# Altium project RFID_system.PrjPcb
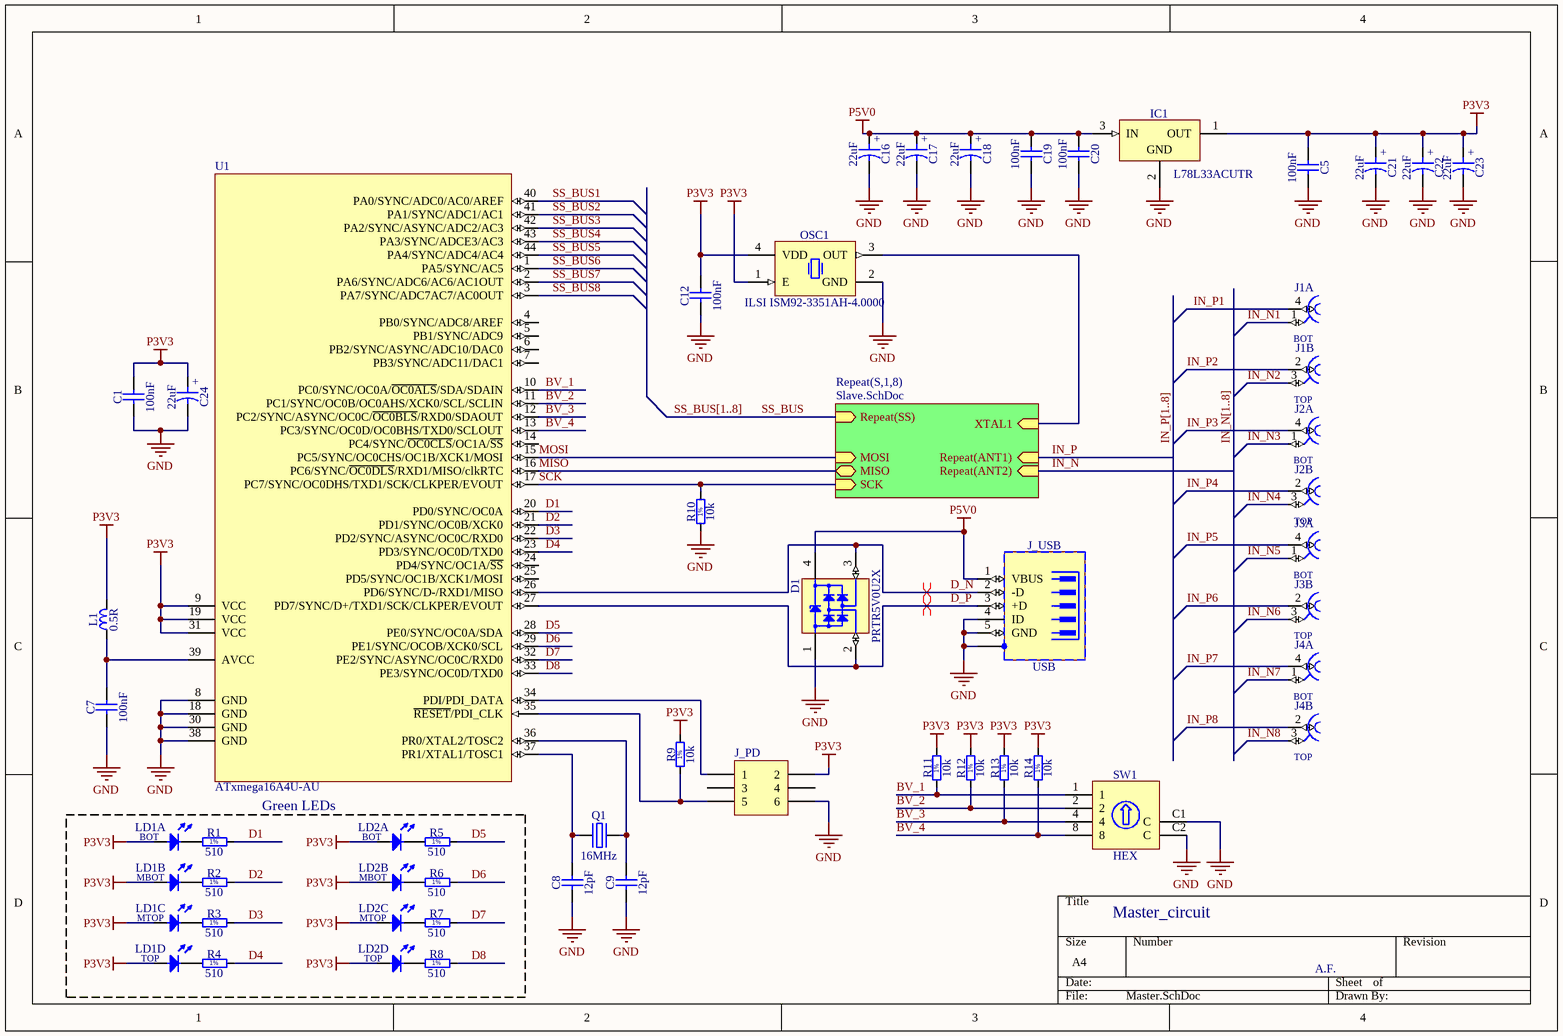
[diagram p0: Master.SchDoc]
2 sheets, 212 parts. Net scope: hierarchical (ports join the sheet entries above them; power ports are global).
Board file: RFID_PCB.PcbDoc
Sheets:
  Master.SchDoc
    S1 = Slave.SchDoc
    S2 = Slave.SchDoc
    S3 = Slave.SchDoc
    S4 = Slave.SchDoc
    S5 = Slave.SchDoc
    S6 = Slave.SchDoc
    S7 = Slave.SchDoc
    S8 = Slave.SchDoc

## Sheet Master.SchDoc: Master_circuit
size A4; DrawnBy: A.F.; ProjectName: RFID_system

### Parts
C1  100nF  [CAPC1608X87N]
C5  100nF  [CAPC1608X87N]
C7  100nF  [CAPC1608X87N]
C8  12pF  [CAPC1608X87N]
C9  12pF  [CAPC1608X87N]
C12  100nF  [CAPC1608X87N]
C16  22uF  [CAPAE430X540N]
C17  22uF  [CAPAE430X540N]
C18  22uF  [CAPAE430X540N]
C19  100nF  [CAPC1608X87N]
C20  100nF  [CAPC1608X87N]
C21  22uF  [CAPAE430X540N]
C22  22uF  [CAPAE430X540N]
C23  22uF  [CAPAE430X540N]
C24  22uF  [CAPAE430X540N]
D1  PRTR5V0U2X  [SOT190P230X110-4N]
IC1  L78L33ACUTR  [SOT89]
J1  Family  [RENHOTEC_RHT-610-0049]  (value not drawn)  (parts A,B of 2)
J2  Family  [RENHOTEC_RHT-610-0049]  (value not drawn)  (parts A,B of 2)
J3  Family  [RENHOTEC_RHT-610-0049]  (value not drawn)  (parts A,B of 2)
J4  Family  [RENHOTEC_RHT-610-0049]  (value not drawn)  (parts A,B of 2)
J_PD  (no value)  [HDR2X3]
J_USB  USB  [WURTH_651005136521]
L1  0.5R  [1608[0603]]
LD1  Green  [LED_BIVAR_H485CGDL]  (value not drawn)  (parts A,B,C,D of 4)
LD2  Green  [LED_BIVAR_H485CGDL]  (value not drawn)  (parts A,B,C,D of 4)
OSC1  ILSI ISM92-3351AH-4.0000  [OSCSC250P320X500X130-4N]
Q1  16MHz  [XTAL1160X490X430]
R1  510  [RESC1608X55N]
R2  510  [RESC1608X55N]
R3  510  [RESC1608X55N]
R4  510  [RESC1608X55N]
R5  510  [RESC1608X55N]
R6  510  [RESC1608X55N]
R7  510  [RESC1608X55N]
R8  510  [RESC1608X55N]
R9  10k  [RESC1608X55N]
R10  10k  [RESC1608X55N]
R11  10k  [RESC1608X55N]
R12  10k  [RESC1608X55N]
R13  10k  [RESC1608X55N]
R14  10k  [RESC1608X55N]
SW1  HEX  [SW_OMRON_A6RV-162RF]
U1  ATxmega16A4U-AU  [44A_N]

### Blocks framed on the sheet
Green LEDs: LD1 LD2 R1-R8

### Sub-sheets
Repeat(S,1,8) = Slave.SchDoc: MOSI (in), MISO, SCK (in), Repeat(SS) (in), Repeat(ANT1) (in), Repeat(ANT2) (in), XTAL1 (in)

### Nets
GND: C1.1 C5.2 C7.1 C8.1 C9.1 C12.1 C16.2 C17.2 C18.2 C19.2 C20.2 C21.2 C22.2 C23.2 C24.2 D1.1(GND) IC1.2(GND) J_PD.6 J_USB.4(ID) J_USB.5(GND) J_USB.6(SH) OSC1.2(GND) R10.1 SW1.C1(C) SW1.C2(C) U1.8(GND) U1.18(GND) U1.30(GND) U1.38(GND)
P3V3: C1.2 C5.1 C12.2 C21.1 C22.1 C23.1 C24.1 IC1.1(OUT) J_PD.2 L1.2 LD1.2(A) LD1.4(A) LD1.6(A) LD1.8(A) LD2.2(A) LD2.4(A) LD2.6(A) LD2.8(A) OSC1.1(E) OSC1.4(VDD) R9.2 R11.2 R12.2 R13.2 R14.2 U1.9(VCC) U1.19(VCC) U1.31(VCC)
P5V0: C16.1 C17.1 C18.1 C19.1 C20.1 D1.4(VCC) IC1.3(IN) J_USB.1(VBUS)
BV_1: R11.1 SW1.1 U1.10(PC0/SYNC/OC0A/~{OC0ALS}/SDA/SDAIN)
BV_2: R12.1 SW1.2 U1.11(PC1/SYNC/OC0B/OC0AHS/XCK0/SCL/SCLIN)
BV_3: R13.1 SW1.4 U1.12(PC2/SYNC/ASYNC/OC0C/~{OC0BLS}/RXD0/SDAOUT)
BV_4: R14.1 SW1.8 U1.13(PC3/SYNC/OC0D/OC0BHS/TXD0/SCLOUT)
D1: R1.2 U1.20(PD0/SYNC/OC0A)
D2: R2.2 U1.21(PD1/SYNC/OC0B/XCK0)
D3: R3.2 U1.22(PD2/SYNC/ASYNC/OC0C/RXD0)
D4: R4.2 U1.23(PD3/SYNC/OC0D/TXD0)
D5: R5.2 U1.28(PE0/SYNC/OC0A/SDA)
D6: R6.2 U1.29(PE1/SYNC/OCOB/XCK0/SCL)
D7: R7.2 U1.32(PE2/SYNC/ASYNC/OC0C/RXD0)
D8: R8.2 U1.33(PE3/SYNC/OC0D/TXD0)
D_N: D1.3(I/O2) J_USB.2(-D) U1.26(PD6/SYNC/D-/RXD1/MISO)
D_P: D1.2(I/O1) J_USB.3(+D) U1.27(PD7/SYNC/D+/TXD1/SCK/CLKPER/EVOUT)
IN_N: sheet Repeat(S,1,8)/Repeat(ANT2)
IN_N1: J1.1
IN_N2: J1.3
IN_N3: J2.1
IN_N4: J2.3
IN_N5: J3.1
IN_N6: J3.3
IN_N7: J4.1
IN_N8: J4.3
IN_P: sheet Repeat(S,1,8)/Repeat(ANT1)
IN_P1: J1.4
IN_P2: J1.2
IN_P3: J2.4
IN_P4: J2.2
IN_P5: J3.4
IN_P6: J3.2
IN_P7: J4.4
IN_P8: J4.2
MISO: U1.16(PC6/SYNC/~{OC0DLS}/RXD1/MISO/clkRTC) ; sheet Repeat(S,1,8)/MISO
MOSI: U1.15(PC5/SYNC/OC0CHS/OC1B/XCK1/MOSI) ; sheet Repeat(S,1,8)/MOSI
SCK: R10.2 U1.17(PC7/SYNC/OC0DHS/TXD1/SCK/CLKPER/EVOUT) ; sheet Repeat(S,1,8)/SCK
SS_BUS: sheet Repeat(S,1,8)/Repeat(SS)
SS_BUS1: U1.40(PA0/SYNC/ADC0/AC0/AREF)
SS_BUS2: U1.41(PA1/SYNC/ADC1/AC1)
SS_BUS3: U1.42(PA2/SYNC/ASYNC/ADC2/AC3)
SS_BUS4: U1.43(PA3/SYNC/ADCE3/AC3)
SS_BUS5: U1.44(PA4/SYNC/ADC4/AC4)
SS_BUS6: U1.1(PA5/SYNC/AC5)
SS_BUS7: U1.2(PA6/SYNC/ADC6/AC6/AC1OUT)
SS_BUS8: U1.3(PA7/SYNC/ADC7AC7/AC0OUT)
XTAL1: OSC1.3(OUT) ; sheet Repeat(S,1,8)/XTAL1
NetC7_2: C7.2 L1.1 U1.39(AVCC)
NetC8_2: C8.2 Q1.1(OSC1) U1.37(PR1/XTAL1/TOSC1)
NetC9_2: C9.2 Q1.2(OSC2) U1.36(PR0/XTAL2/TOSC2)
NetJ_PD_1: J_PD.1 U1.34(PDI/PDI_DATA)
NetJ_PD_5: J_PD.5 R9.1 U1.35(~{RESET}/PDI_CLK)
NetLD1_1: LD1.1(C) R1.1
NetLD1_3: LD1.3(C) R2.1
NetLD1_5: LD1.5(C) R3.1
NetLD1_7: LD1.7(C) R4.1
NetLD2_1: LD2.1(C) R5.1
NetLD2_3: LD2.3(C) R6.1
NetLD2_5: LD2.5(C) R7.1
NetLD2_7: LD2.7(C) R8.1

Not connected (* = marked no-connect by the designer): J_PD 3 4; U1 4(PB0/SYNC/ADC8/AREF) 5(PB1/SYNC/ADC9) 6(PB2/SYNC/ASYNC/ADC10/DAC0) 7(PB3/SYNC/ADC11/DAC1) 14(PC4/SYNC/~{OC0CLS}/OC1A/~{SS}) 24(PD4/SYNC/OC1A/~{SS}) 25(PD5/SYNC/OC1B/XCK1/MOSI)

### Buses and harness runs
bus IN_N[1..8]
bus IN_P[1..8]
bus SS_BUS[1..8]

### Layout directives
differential pair: D_N, D_P

### Notes on the sheet
- Labels drawn without touching a wire or pin: \
- (in symbol CAE430-540_22UF_10V_20%) +
- (in symbol CON_BNC_DUAL, part A) BOT
- (in symbol CON_BNC_DUAL, part B) TOP
- (in symbol LED x4 Green 1C2A-BOT_3C4A_5C6A_7C8A-TOP, part A) BOT
- (in symbol LED x4 Green 1C2A-BOT_3C4A_5C6A_7C8A-TOP, part B) MBOT
- (in symbol LED x4 Green 1C2A-BOT_3C4A_5C6A_7C8A-TOP, part C) MTOP
- (in symbol LED x4 Green 1C2A-BOT_3C4A_5C6A_7C8A-TOP, part D) TOP
- (in symbol R0603_10K_1%_0.1W_100PPM) 1%
- (in symbol R0603_510R_1%_0.1W_100PPM) 1%

### Library data of the parts
C1 C5 C7 C12 C19 C20 = CC0603_100NF_50V_10%_X5R: Non-polarised capacitor; Part Description: SMD Multilayer Chip Ceramic Capacitor; Manufacturer: GENERIC; Manufacturer1 Part Number: C1608X5R1H104K080AA; Voltage: 50V; TC: X5R; Tolerance: ±10%; Part Number: CC0603_100NF_50V_10%_X5R; Component Kind: Standard; Component Type: Standard; Pin Count: 2; Value: 100nF; Status: None; Manufacturer Part Number: CC0603_100NF_50V_10%_X5R; Case: 0603; Mounted: Yes; Socket: No; SMD: Yes; Sense: No; Manufacturer1 Example: TDK; Manufacturer1 ComponentHeight: 0.9mm; HelpURL: \\cern.ch\dfs\Applications\Altium\Datasheets\CC0603_X5R_TDK_C.pdf; Author: CERN DEM MR; CreateDate: 08.01.2016; LatestRevisionDate: 08.01.2016
C8 C9 = CC0603_12PF_50V_5%_NP0: Non-polarised capacitor; Part Description: SMD Multilayer Chip Ceramic Capacitor; Manufacturer: GENERIC; Manufacturer1 Part Number: 223886715129; Voltage: 50V; TC: C0G/NP0; Tolerance: ±5%; Part Number: CC0603_12PF_50V_5%_NP0; Component Kind: Standard; Component Type: Standard; Pin Count: 2; Value: 12pF; Status: Preferred; Manufacturer Part Number: CC0603_12PF_50V_5%_NP0; Case: 0603; Mounted: Yes; Socket: No; SMD: Yes; Sense: No; Manufacturer1 Example: PHYCOMP; Manufacturer1 ComponentHeight: 0.87mm; HelpURL: \\cern.ch\dfs\Applications\Altium\Datasheets\CC0603_NP0_PHYCOMP.pdf; Author: CERN DEM JLC; CreateDate: 03.12.2007; LatestRevisionDate: 03.12.2007
C16-C18 C21-C24 = CAE430-540_22UF_10V_20%: Polarised capacitor; Part Description: Aluminum Electrolytic SMT Capacitor; Manufacturer: PANASONIC; Manufacturer Part Number: EEEFK1A220AR; Voltage: 10V; Tolerance: ±20%; Part Number: CAE430-540_22UF_10V_20%; Component Kind: Standard; Component Type: Standard; Pin Count: 2; Value: 22uF; Status: Not Recommended; Case: B; Mounted: Yes; Socket: No; SMD: Yes; Sense: No; ComponentHeight: 5.8mm; HelpURL: \\cern.ch\dfs\Applications\Altium\Datasheets\CAE_PANASONIC_FK.pdf; Author: CERN DEM JLC; CreateDate: 2007-12-03; LatestRevisionDate: 2014-11-05
D1 = PRTR5V0U2X: Ultra Low Capacitance Double Rail-to-Rail ESD Protection Diode; Part Description: Ultra Low Capacitance (1pF) Double Rail-to-Rail ESD Protection Diode (8kV); Manufacturer: NXP SEMICONDUCTORS; Voltage: 5.5V; PressFit: No; Bonding: No; Part Number: PRTR5V0U2X; Component Kind: Standard; Component Type: Standard; Device: PRTR5V0U2X; PackageDescription: SOT143B, SOT, 1.90mm Pitch; 4 Pin, 1.30mm W X 2.90mm L X 1.10mm H body, IPC Medium Density; Manufacturer Part Number: PRTR5V0U2X; Pin Count: 4; Case: SOT143B; Mounted: Yes; Socket: No; SMD: Yes; Sense: No; ComponentHeight: 1.1mm; HelpURL: \\cern.ch\dfs\Applications\Altium\Datasheets\PRTR5V0U2X.pdf; Author: CERN DEM JLC; CreateDate: 2011-03-22; LatestRevisionDate: 2011-03-22
IC1 = L78L33ACUTR: 3-Terminal Regulator 1=OUT 2=GND 3=IN; Part Description: 33V 100mA Positive Voltage Regulator; Manufacturer: ST MICROELECTRONICS; PressFit: No; Bonding: No; Part Number: L78L33ACUTR; Component Kind: Standard; Component Type: Standard; Device: L78L33ACUTR; PackageDescription: SOT89-3, 3-Leads, Body 2.44x4.5mm; Manufacturer Part Number: L78L33ACUTR; Pin Count: 4; Case: SOT89; Mounted: Yes; Socket: No; SMD: Yes; Sense: No; ComponentHeight: 1.6mm; HelpURL: \\cern.ch\dfs\Applications\Altium\Datasheets\L78L33ACUTR.pdf; Author: CERN DEM JLC; CreateDate: 2014-05-12; LatestRevisionDate: 2014-05-12
J1-J4 = CON_BNC_DUAL: Dual Right Angle 50 Ohm BNC Jack, White Valox Case; Manufacturer: RENHOTEC; Manufacturer Part Number: RHT-610-0049; PressFit: No; Part Number: RENHOTEC_RHT-610-0049; Component Kind: Standard; Component Type: Standard; Pin Count: 6; Family: BNC; Mounted: Yes; Socket: No; SMD: No; Sense: No; Status: None; Part Description: Dual Right Angle 50 Ohm BNC Jack, White Valox Case; ComponentHeight: 29.3mm; HelpURL: \\cern.ch\dfs\Applications\Altium\Datasheets\BOMAR_364A2595.pdf; Author: GK; CreateDate: 09.04.2013; LatestRevisionDate: 09.04.2013
J_PD = Header 3X2: Header, 3-Pin, Dual row; LatestRevisionDate: 17-Jul-2002; LatestRevisionNote: Re-released for DXP Platform.; Publisher: Altium Limited
J_USB = WURTH_651005136521: 5 Pin + 1 Shield USB Receptacle; Part Description: Mini USB Type B  Receptacle, Horizontal, 5 Contacts; Manufacturer: WURTH ELEKTRONIK; PressFit: No; Part Number: WURTH_651005136521; Component Kind: Standard; Component Type: Standard; Pin Count: 6; Family: USB; Mounted: Yes; Socket: No; SMD: No; Sense: No; Status: None; Manufacturer Part Number: 651005136521; ComponentHeight: 3.9mm; HelpURL: \\cern.ch\dfs\Applications\Altium\Datasheets\WURTH_651005136521.pdf; Author: CERN DEM JLC; CreateDate: 2011-03-07; LatestRevisionDate: 2011-03-07
L1 = IND_1UH_20%_BOURNS_SRP4020TA: Ferrite Bead; Manufacturer: MURATA; Part number: BLM18HE152SN1D; Power: 0.5A; Impedence at 100MHZ: 1500R; Footprint: 0603; Pin Count: 2; Value: 0.5R; Status: None; Resistance: 0.5R; Part Description: Ferrite bead; Mounted: Yes; Socket: No; SMD: Yes; HelpURL: https://www.tme.eu/html/EN/murata-smd-beads/ramka_6596_EN_pelny.html; Author: CERN DEM BC; Producer: Murata
LD1 LD2 = LED x4 Green 1C2A-BOT_3C4A_5C6A_7C8A-TOP: Part Description: Quad-Level 2mm Green LED, PCB Edge Mounting; Manufacturer: BIVAR; Manufacturer Part Number: H485CGDL; PressFit: No; Bonding: No; Part Number: LED_BIVAR_H485CGDL; Component Kind: Standard; Component Type: Standard; Color: Green; PackageDescription: Quad-Level 2mm Green, PCB Edge Mounting  BIVAR H485CHDL; Pin Count: 8; Mounted: Yes; Socket: No; SMD: No; Sense: No; ComponentHeight: 11.3mm; HelpURL: \\cern.ch\dfs\Applications\Altium\Datasheets\LED_BIVAR_H485CGDL.pdf; Author: CERN DEM JLC; CreateDate: 2012-06-04; LatestRevisionDate: 2012-06-04
OSC1 = Oscillator 1E 2GND 3OUT 4VDD: Oscillator 4 pins 3.3V 4MHz; URL: https://www.tme.eu/pl/Document/04fa0ef07f38450711886bdf482cf79c/ISM92_Series.pdf
Q1 = XTAL_16MHZ_IQD_LFXTAL003237: Quartz Crystal; Part Description: Tolerance: ± 30ppm, Stability: ± 50ppm, -10°C to +60°C, 16pF, Surface Mount Quartz Crystal, HC49/4HSMX Series; Manufacturer: IQD FREQUENCY PRODUCTS; PressFit: No; Bonding: No; Part Number: XTAL_16MHZ_IQD_LFXTAL003237; Component Kind: Standard; Component Type: Standard; PackageDescription: HC49/4H SMX Case, SMD Cristal, Body 11.6x4.9mm; Value: 16MHz; Manufacturer Part Number: LF XTAL003237; Pin Count: 2; Mounted: Yes; Socket: No; SMD: Yes; Sense: No; ComponentHeight: 4.3mm; HelpURL: \\cern.ch\dfs\Applications\Altium\Datasheets\XTAL_IQD_LFXTAL003237.pdf; Author: CERN DEM MR; CreateDate: 2016-03-23; LatestRevisionDate: 2016-11-07
R1-R8 = R0603_510R_1%_0.1W_100PPM: Resistor - 1%; Part Description: General Purpose Thick Film Chip Resistor; Manufacturer: GENERIC; Manufacturer1 Part Number: NRC06F5100TRF; Power: 0.1W; TC: ±100ppm/°C; PressFit: No; Part Number: R0603_510R_1%_0.1W_100PPM; Component Kind: Standard; Component Type: Standard; Pin Count: 2; Value: 510; Status: Preferred; Tolerance: ±1%; Manufacturer Part Number: R0603_510R_1%_0.1W_100PPM; Case: 0603; Mounted: Yes; Sense: No; Socket: No; SMD: Yes; Manufacturer1 Example: NIC COMPONENT; Manufacturer1 ComponentHeight: 0.55mm; HelpURL: \\cern.ch\dfs\Applications\Altium\Datasheets\R0603_NIC_NRC.pdf; Author: CERN DEM JLC; CreateDate: 2007-12-03; LatestRevisionDate: 2008-03-13
R9-R14 = R0603_10K_1%_0.1W_100PPM: Resistor - 1%; Part Description: General Purpose Thick Film Chip Resistor; Manufacturer: GENERIC; Manufacturer1 Part Number: NRC06F1002TRF; Power: 0.1W; TC: ±100ppm/°C; PressFit: No; Part Number: R0603_10K_1%_0.1W_100PPM; Component Kind: Standard; Component Type: Standard; Pin Count: 2; Value: 10k; Status: Preferred; Tolerance: ±1%; Manufacturer Part Number: R0603_10K_1%_0.1W_100PPM; Case: 0603; Mounted: Yes; Sense: No; Socket: No; SMD: Yes; Manufacturer1 ComponentHeight: 0.55mm; HelpURL: \\cern.ch\dfs\Applications\Altium\Datasheets\R0603_NIC_NRC.pdf; Author: CERN DEM JLC; CreateDate: 03.12.2007; LatestRevisionDate: 13.03.2008; Manufacturer1 Example: NIC COMPONENT
SW1 = SW_OMRON_A6RV-162RF: Rotary Code Switch 1 2 4 8 C1 C2; Part Number: SW_OMRON_A6RV-162RF or ERD716RR; Part Description: Side Actuated, Hexadecimal Rotary Code Switch; Manufacturer: OMRON; Manufacturer Part Number: A6RV-162RF or ERD716RR; PressFit: No; Component Kind: Standard; Component Type: Standard; Pin Count: 6; PackageDescription: Body 9.8x6.64mm, Side Actuated, Rotary Code Switch, OMRON A6RV Series; Family: HEX; Mounted: Yes; Socket: No; SMD: No; Sense: No; Status: None; ComponentHeight: 9.9mm; HelpURL: \\cern.ch\dfs\Applications\Altium\Datasheets\SW_OMRON_A6RV.pdf; Author: CERN DEM JLC; CreateDate: 2008-11-27; LatestRevisionDate: 2011-01-19
U1 = ATxmega16A4-AU: 8/16-bit AVR XMEGA A4 Microcontroller, 1.6-3.6V, 16KB + 4KB Flash, 1KB EEPROM, 2KB SRAM, 44-pin TQFP, Industrial Grade (-40°C to 85°C), Pb-Free; Published: 1-Apr-2010; DatasheetVersion: revN, Feb-2010; PackageVersion: rev.B, Oct-2001; PackageReference: 44A; Publisher: Altium Limited; PackageDescription: 44-Pin Plastic Thin Profile Quad Flat Pack, 10 x 10 x 1.0 mm Body, 0.8 mm Pitch (TQFP); Supplier 1: Digi-Key; Supplier Part Number 1: ATXMEGA16A4-AU-ND; Supplier 2: Farnell; Supplier Part Number 2: 1748552; Supplier 3: Mouser; Supplier Part Number 3: 556-ATXMEGA16A4-AU; ComponentLink1Description: Manufacturer Link; ComponentLink1URL: http://www.atmel.com/products/avr/default.asp?; ComponentLink2Description: ATxmega16A4/32A4/64A4/128A4 Datasheet; ComponentLink2URL: http://www.atmel.com/dyn/resources/prod_documents/doc8069.pdf; ComponentLink3Description: Atmel.com Home; ComponentLink3URL: http://www.atmel.com

## Sheet Slave.SchDoc: Slave_subcircuit
size A4; DrawnBy: A.F
Used 8 times, as channels S1, S2, S3, S4, S5, S6, S7, S8. Parts and nets are listed once, with the designators drawn on the sheet.
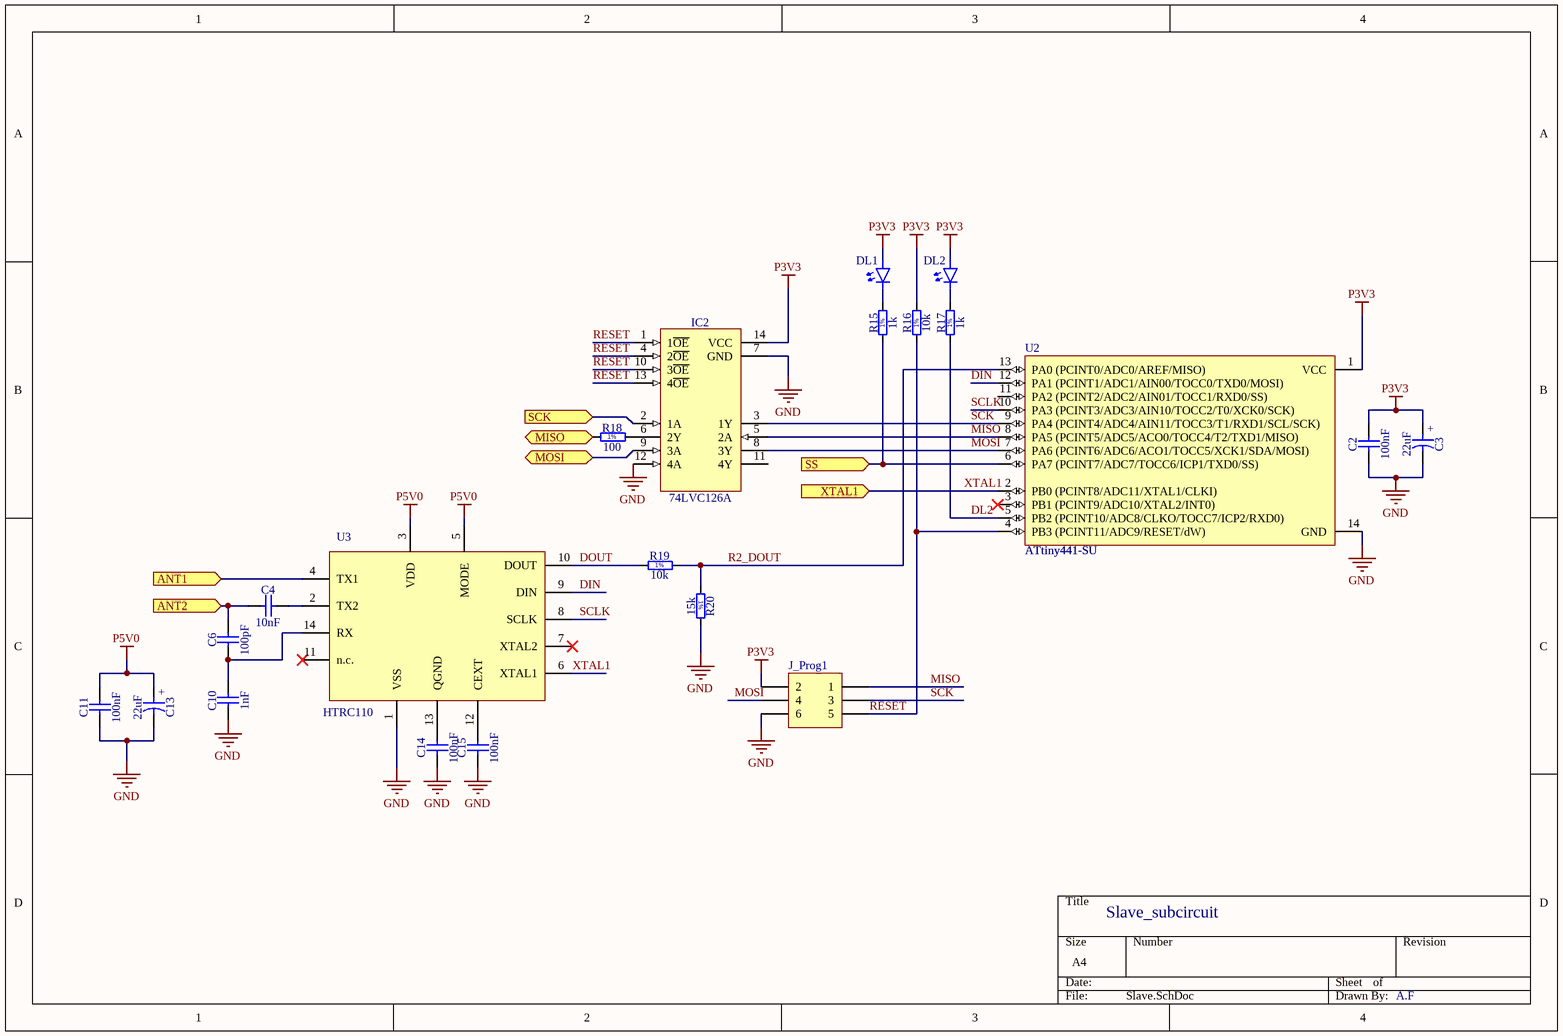
[diagram p1: Slave.SchDoc]

### Parts
C2  100nF  [CAPC1608X87N]
C3  22uF  [CAPAE430X540N]
C4  10nF  [CAPC1608X87N]
C6  100pF  [CAPC1608X90N]
C10  1nF  [CAPC1608X87N]
C11  100nF  [CAPC1608X87N]
C13  22uF  [CAPAE430X540N]
C14  100nF  [CAPC1608X87N]
C15  100nF  [CAPC1608X87N]
DL1  (no value)  [0805_LED]
DL2  (no value)  [0805_LED]
IC2  74LVC126A  [SOIC127P600X175-14N]
J_Prog1  (no value)  [HDR2X3]
R15  1k  [RESC1608X50N]
R16  10k  [RESC1608X50N]
R17  1k  [RESC1608X50N]
R18  100  [RESC1608X50N]
R19  10k  [RESC1608X50N]
R20  15k  [RESC1608X50N]
U2  ATtiny441-SU  [14S1_L]
U3  HTRC110  [SOIC127P600X175-14N]

### Ports
ANT1 (in), ANT2 (in), MISO (out), MOSI (bidir), SCK (in), SS (in), XTAL1 (in)

### Nets
GND: C2.1 C3.2 C10.1 C11.1 C13.2 C14.1 C15.1 IC2.7(GND) IC2.12(4A) J_Prog1.6 R20.2 U2.14(GND) U3.1(VSS)
P3V3: C2.2 C3.1 DL1.A DL2.A IC2.14(VCC) J_Prog1.2 R16.2 U2.1(VCC)
P5V0: C11.2 C13.1 U3.3(VDD) U3.5(MODE)
ANT1: U3.4(TX1) ; port ANT1
ANT2: C4.1 C6.2 ; port ANT2
DIN: U2.12(PA1_(PCINT1/ADC1/AIN00/TOCC0/TXD0/MOSI)) U3.9(DIN)
DL2: R17.1 U2.5(PB2_(PCINT10/ADC8/CLKO/TOCC7/ICP2/RXD0))
DOUT: R19.1 U3.10(DOUT)
MISO: IC2.5(2A) J_Prog1.1 U2.8(PA5_(PCINT5/ADC5/ACO0/TOCC4/T2/TXD1/MISO))
MISO: R18.1 ; port MISO  [a separate net that carries the same name]
MOSI: IC2.8(3Y) J_Prog1.4 U2.7(PA6_(PCINT6/ADC6/ACO1/TOCC5/XCK1/SDA/MOSI))
MOSI: IC2.9(3A) ; port MOSI  [a separate net that carries the same name]
R2_DOUT: R19.2 R20.1 U2.13(PA0_(PCINT0/ADC0/AREF/MISO))
RESET: IC2.1(1~{OE}) IC2.4(2~{OE}) IC2.10(3~{OE}) IC2.13(4~{OE}) J_Prog1.5 R16.1 U2.4(PB3_(PCINT11/ADC9/RESET/dW))
SCK: IC2.3(1Y) J_Prog1.3 U2.9(PA4_(PCINT4/ADC4/AIN11/TOCC3/T1/RXD1/SCL/SCK))
SCK: IC2.2(1A) ; port SCK  [a separate net that carries the same name]
SCLK: U2.10(PA3_(PCINT3/ADC3/AIN10/TOCC2/T0/XCK0/SCK)) U3.8(SCLK)
SS: R15.1 U2.6(PA7_(PCINT7/ADC7/TOCC6/ICP1/TXD0/SS)) ; port SS
XTAL1: U2.2(PB0_(PCINT8/ADC11/XTAL1/CLKI)) U3.6(XTAL1) ; port XTAL1
NetC4_2: C4.2 U3.2(TX2)
NetC6_1: C6.1 C10.2 U3.14(RX)
NetC14_2: C14.2 U3.13(QGND)
NetC15_2: C15.2 U3.12(CEXT)
NetDL1_K: DL1.K R15.2
NetDL2_K: DL2.K R17.2
NetIC2_6: IC2.6(2Y) R18.2

Not connected (* = marked no-connect by the designer): IC2 11(4Y); U2 3(PB1_(PCINT9/ADC10/XTAL2/INT0))* 11(PA2_(PCINT2/ADC2/AIN01/TOCC1/RXD0/SS)); U3 7(XTAL2)* 11(n.c.)*

### Channels
S1: designators C2=C2A C3=C1A C4=C5A C6=C6A C10=C7A C11=C3A C13=C4A C14=C8A C15=C9A DL1=DL1A DL2=DL2A IC2=IC1A J_Prog1=J_ProgA R15=R4A R16=R5A R17=R6A R18=R1A R19=R2A R20=R3A U2=U1A U3=U2A; ports ANT1=IN_P1 ANT2=IN_N1 MISO=MISO MOSI=MOSI SCK=SCK SS=SS_BUS1 XTAL1=XTAL1
S2: designators C2=C2B C3=C1B C4=C5B C6=C6B C10=C7B C11=C3B C13=C4B C14=C8B C15=C9B DL1=DL1B DL2=DL2B IC2=IC1B J_Prog1=J_ProgB R15=R4B R16=R5B R17=R6B R18=R1B R19=R2B R20=R3B U2=U1B U3=U2B; ports ANT1=IN_P2 ANT2=IN_N2 MISO=MISO MOSI=MOSI SCK=SCK SS=SS_BUS2 XTAL1=XTAL1
S3: designators C2=C2C C3=C1C C4=C5C C6=C6C C10=C7C C11=C3C C13=C4C C14=C8C C15=C9C DL1=DL1C DL2=DL2C IC2=IC1C J_Prog1=J_ProgC R15=R4C R16=R5C R17=R6C R18=R1C R19=R2C R20=R3C U2=U1C U3=U2C; ports ANT1=IN_P3 ANT2=IN_N3 MISO=MISO MOSI=MOSI SCK=SCK SS=SS_BUS3 XTAL1=XTAL1
S4: designators C2=C2D C3=C1D C4=C5D C6=C6D C10=C7D C11=C3D C13=C4D C14=C8D C15=C9D DL1=DL1D DL2=DL2D IC2=IC1D J_Prog1=J_ProgD R15=R4D R16=R5D R17=R6D R18=R1D R19=R2D R20=R3D U2=U1D U3=U2D; ports ANT1=IN_P4 ANT2=IN_N4 MISO=MISO MOSI=MOSI SCK=SCK SS=SS_BUS4 XTAL1=XTAL1
S5: designators C2=C2E C3=C1E C4=C5E C6=C6E C10=C7E C11=C3E C13=C4E C14=C8E C15=C9E DL1=DL1E DL2=DL2E IC2=IC1E J_Prog1=J_ProgE R15=R4E R16=R5E R17=R6E R18=R1E R19=R2E R20=R3E U2=U1E U3=U2E; ports ANT1=IN_P5 ANT2=IN_N5 MISO=MISO MOSI=MOSI SCK=SCK SS=SS_BUS5 XTAL1=XTAL1
S6: designators C2=C2F C3=C1F C4=C5F C6=C6F C10=C7F C11=C3F C13=C4F C14=C8F C15=C9F DL1=DL1F DL2=DL2F IC2=IC1F J_Prog1=J_ProgF R15=R4F R16=R5F R17=R6F R18=R1F R19=R2F R20=R3F U2=U1F U3=U2F; ports ANT1=IN_P6 ANT2=IN_N6 MISO=MISO MOSI=MOSI SCK=SCK SS=SS_BUS6 XTAL1=XTAL1
S7: designators C2=C2G C3=C1G C4=C5G C6=C6G C10=C7G C11=C3G C13=C4G C14=C8G C15=C9G DL1=DL1G DL2=DL2G IC2=IC1G J_Prog1=J_ProgG R15=R4G R16=R5G R17=R6G R18=R1G R19=R2G R20=R3G U2=U1G U3=U2G; ports ANT1=IN_P7 ANT2=IN_N7 MISO=MISO MOSI=MOSI SCK=SCK SS=SS_BUS7 XTAL1=XTAL1
S8: designators C2=C2H C3=C1H C4=C5H C6=C6H C10=C7H C11=C3H C13=C4H C14=C8H C15=C9H DL1=DL1H DL2=DL2H IC2=IC1H J_Prog1=J_ProgH R15=R4H R16=R5H R17=R6H R18=R1H R19=R2H R20=R3H U2=U1H U3=U2H; ports ANT1=IN_P8 ANT2=IN_N8 MISO=MISO MOSI=MOSI SCK=SCK SS=SS_BUS8 XTAL1=XTAL1

### Notes on the sheet
- (in symbol CAE430-540_22UF_10V_20%) +
- (in symbol R0603_10K_1%_0.1W_100PPM) 1%
- (in symbol R0603_15K_1%_0.1W_100PPM) 1%
- (in symbol R0603_100R_1%_0.1W_100PPM) 1%
- (in symbol R0805_1K_1%_0.33W_100PPM_VISHAY_CRCW-HP) 1%

### Library data of the parts
C2 C14 C15 = CC0603_100NF_50V_10%_X5R: as C1 on sheet Master; Part Number: CC0603_100NF_50V_10%_X5R; Component Kind: Standard; Component Type: Standard; Pin Count: 2; Value: 100nF; Status: None; Manufacturer Part Number: CC0603_100NF_50V_10%_X5R; Case: 0603; Mounted: Yes; Socket: No; SMD: Yes; Sense: No; Manufacturer1 Example: TDK; Manufacturer1 ComponentHeight: 0.9mm; HelpURL: \\cern.ch\dfs\Applications\Altium\Datasheets\CC0603_X5R_TDK_C.pdf; Author: CERN DEM MR; CreateDate: 08.01.2016; LatestRevisionDate: 08.01.2016
C3 C13 = CAE430-540_22UF_10V_20%: as C16 on sheet Master; Part Number: CAE430-540_22UF_10V_20%; Component Kind: Standard; Component Type: Standard; Pin Count: 2; Value: 22uF; Status: Not Recommended; Case: B; Mounted: Yes; Socket: No; SMD: Yes; Sense: No; ComponentHeight: 5.8mm; HelpURL: \\cern.ch\dfs\Applications\Altium\Datasheets\CAE_PANASONIC_FK.pdf; Author: CERN DEM JLC; CreateDate: 2007-12-03; LatestRevisionDate: 2014-11-05
C4 = CC0603_10NF_50V_10%_X7R: Non-polarised capacitor; Part Description: SMD Multilayer Chip Ceramic Capacitor; Manufacturer: GENERIC; Manufacturer1 Part Number: 223858615636; Voltage: 50V; TC: X7R; Tolerance: ±10%; Part Number: CC0603_10NF_50V_10%_X7R; Component Kind: Standard; Component Type: Standard; Pin Count: 2; Value: 10nF; Status: Preferred; Manufacturer Part Number: CC0603_10NF_50V_10%_X7R; Case: 0603; Mounted: Yes; Socket: No; SMD: Yes; Sense: No; Manufacturer1 Example: PHYCOMP; Manufacturer1 ComponentHeight: 0.87mm; HelpURL: \\cern.ch\dfs\Applications\Altium\Datasheets\CC0603_X7R_PHYCOMP.pdf; Author: CERN DEM JLC; CreateDate: 2007-12-03; LatestRevisionDate: 2007-12-03
C6 = CC0603_100PF_250V_5%_ATC_600S: Non-polarised capacitor; Part Description: Ultra-Low ESR, High Q, NPO RF & Microwave Capacitor; Manufacturer: AMERICAN TECHNICAL CERAMICS (ATC); Manufacturer Part Number: 600S101JT250XT; Voltage: 250V; TC: C0G/NP0; Tolerance: ±5%; Part Number: CC0603_100PF_250V_5%_ATC_600S; Component Kind: Standard; Component Type: Standard; Pin Count: 2; Value: 100pF; Status: Not Recommended; Case: 0603; Mounted: Yes; Socket: No; SMD: Yes; Sense: No; ComponentHeight: 0.89mm; HelpURL: \\cern.ch\dfs\Applications\Altium\Datasheets\CC0603_ATC_600S.pdf; Author: CERN DEM JMW; CreateDate: 2016-08-11; LatestRevisionDate: 2016-08-11
C10 C11 = CC0603_10NF_50V_10%_X7R: Non-polarised capacitor; Part Description: SMD Multilayer Chip Ceramic Capacitor; Manufacturer: GENERIC; Manufacturer1 Part Number: 223858615636; Value: 10nF; Voltage: 50V; TC: X7R; Tolerance: ±10%; Part Number: CC0603_10NF_50V_10%_X7R; Component Kind: Standard; Component Type: Standard; Pin Count: 2; Status: Preferred; Manufacturer Part Number: CC0603_10NF_50V_10%_X7R; Case: 0603; Mounted: Yes; Socket: No; SMD: Yes; Sense: No; Manufacturer1 Example: PHYCOMP; Manufacturer1 ComponentHeight: 0.87mm; HelpURL: \\cern.ch\dfs\Applications\Altium\Datasheets\CC0603_X7R_PHYCOMP.pdf; Author: CERN DEM JLC; CreateDate: 2007-12-03; LatestRevisionDate: 2007-12-03
DL1 DL2 = LED1: Light Emitting Diode
IC2 = 74125: Quadruple Bus Buffer with 3-State Outputs; Manufacturer: TEXAS INSTRUMENTS; PressFit: No; Bonding: No; Part Number: 74LVC126A; Component Kind: Standard; Component Type: Standard; Device: 74LVC126A; PackageDescription: SOIC 14, Pitch 1.27mm - Body 4x8.75mm, IPC Medium Density; Part Description: Quadruple Bus Buffer with 3-State Outputs; Manufacturer Part Number: 74LVC126A; Pin Count: 14; Case: SOIC14; Mounted: Yes; Socket: No; SMD: Yes; Sense: No; ComponentHeight: 1.75mm; Author: CERN DEM JLC; HelpURL: \\cern.ch\dfs\Applications\Altium\Datasheets\SN74HC125D.pdf; CreateDate: 2011-06-30; LatestRevisionDate: 2011-06-30
J_Prog1 = Header 3X2: Header, 3-Pin, Dual row; LatestRevisionDate: 17-Jul-2002; LatestRevisionNote: Re-released for DXP Platform.; Publisher: Altium Limited
R15 R17 = R0805_1K_1%_0.33W_100PPM_VISHAY_CRCW-HP: Resistor - 1%; Part Description: 150V, Pulse Proof, High Power Thick Film Chip Resistor; Manufacturer: VISHAY DRALORIC; Manufacturer Part Number: CRCW08051K00FKEAHP; Power: 0.33W; TC: ±100ppm/°C; PressFit: No; Part Number: R0805_1K_1%_0.33W_100PPM_VISHAY_CRCW-HP; Component Kind: Standard; Component Type: Standard; Footprint: RESC2012X60N; Pin Count: 2; Value: 1k; Status: None; Tolerance: ±1%; Case: 0805; Mounted: Yes; Sense: No; Socket: No; SMD: Yes; Manufacturer1 ComponentHeight: 0.6mm; HelpURL: \\cern.ch\dfs\Applications\Altium\Datasheets\R0805_VISHAY_CRCW-HP e3.pdf; Author: CERN DEM JLC; CreateDate: 2010-06-16; LatestRevisionDate: 2010-06-16
R16 = R0805_1K_1%_0.33W_100PPM_VISHAY_CRCW-HP: Resistor - 1%; Part Description: 150V, Pulse Proof, High Power Thick Film Chip Resistor; Manufacturer: VISHAY DRALORIC; Manufacturer Part Number: CRCW08051K00FKEAHP; Value: 1k; Power: 0.33W; TC: ±100ppm/°C; PressFit: No; Part Number: R0805_1K_1%_0.33W_100PPM_VISHAY_CRCW-HP; Component Kind: Standard; Component Type: Standard; Footprint: RESC2012X60N; Pin Count: 2; Status: None; Tolerance: ±1%; Case: 0805; Mounted: Yes; Sense: No; Socket: No; SMD: Yes; Manufacturer1 ComponentHeight: 0.6mm; HelpURL: \\cern.ch\dfs\Applications\Altium\Datasheets\R0805_VISHAY_CRCW-HP e3.pdf; Author: CERN DEM JLC; CreateDate: 2010-06-16; LatestRevisionDate: 2010-06-16
R18 = R0603_100R_1%_0.1W_100PPM: Resistor - 1%; Part Description: General Purpose Thick Film Chip Resistor; Manufacturer: GENERIC; Manufacturer1 Part Number: NRC06F4700TRF; Power: 0.1W; TC: ±100ppm/°C; PressFit: No; Part Number: R0603_100R_1%_0.1W_100PPM; Component Kind: Standard; Component Type: Standard; Footprint: RESC1608X55N; Pin Count: 2; Value: 100; Status: Preferred; Tolerance: ±1%; Manufacturer Part Number: R0603_100R_1%_0.1W_100PPM; Case: 0603; Mounted: Yes; Sense: No; Socket: No; SMD: Yes; Manufacturer1 Example: NIC COMPONENT; Manufacturer1 ComponentHeight: 0.55mm; HelpURL: \\cern.ch\dfs\Applications\Altium\Datasheets\R0603_NIC_NRC.pdf; Author: CERN DEM JLC; CreateDate: 2007-12-03; LatestRevisionDate: 2008-03-13
R19 = R0603_10K_1%_0.1W_100PPM: as R9 on sheet Master; Part Number: R0603_10K_1%_0.1W_100PPM; Component Kind: Standard; Component Type: Standard; Footprint: RESC1608X55N; Pin Count: 2; Value: 10k; Status: Preferred; Tolerance: ±1%; Manufacturer Part Number: R0603_10K_1%_0.1W_100PPM; Case: 0603; Mounted: Yes; Sense: No; Socket: No; SMD: Yes; Manufacturer1 Example: NIC COMPONENT; Manufacturer1 ComponentHeight: 0.55mm; HelpURL: \\cern.ch\dfs\Applications\Altium\Datasheets\R0603_NIC_NRC.pdf; Author: CERN DEM JLC; CreateDate: 2007-12-03; LatestRevisionDate: 2008-03-13
R20 = R0603_15K_1%_0.1W_100PPM: Resistor - 1%; Part Description: General Purpose Thick Film Chip Resistor; Manufacturer: GENERIC; Manufacturer1 Part Number: NRC06F1502TRF; Power: 0.1W; TC: ±100ppm/°C; PressFit: No; Part Number: R0603_15K_1%_0.1W_100PPM; Component Kind: Standard; Component Type: Standard; Footprint: RESC1608X55N; Pin Count: 2; Value: 15k; Status: Preferred; Tolerance: ±1%; Manufacturer Part Number: R0603_15K_1%_0.1W_100PPM; Case: 0603; Mounted: Yes; Sense: No; Socket: No; SMD: Yes; Manufacturer1 Example: NIC COMPONENT; Manufacturer1 ComponentHeight: 0.55mm; HelpURL: \\cern.ch\dfs\Applications\Altium\Datasheets\R0603_NIC_NRC.pdf; Author: CERN DEM JMW; CreateDate: 2015-08-17; LatestRevisionDate: 2015-08-17
U2 = ATtiny441-SU: 8-bit AVR Microcontroller, 1.8-5.5V, 2KB Flash, 128 Bytes SRAM, 12 GPIO pins, 14-pin SOIC, Industrial Grade (-40°C to 85°C), Pb-Free; Published: 1-Apr-2010; DatasheetVersion: revA, Mar-2010; PackageVersion: revA, Feb-2002; PackageReference: 14S1; Publisher: Altium Limited; PackageDescription: 14-Lead, 0.150” Wide Body, Plastic Gull Wing Small Outline Package (SOIC); Code_JEDEC: MS-012-AB; Code_IPC: SOIC127P600-14; ComponentLink1Description: ATtiny20 Datasheet; ComponentLink1URL: http://www.atmel.com/dyn/resources/prod_documents/doc8235.pdf; ComponentLink2Description: ATtiny20 Summary; ComponentLink2URL: http://www.atmel.com/dyn/resources/prod_documents/8235S.pdf; ComponentLink3Description: Atmel.com Home; ComponentLink3URL: http://www.atmel.com; Supplier 1: Digi-Key; Supplier Part Number 1: 1611-ATTINY44-15SSZCT-ND; Name: ATtiny441-SU
U3 = HTRC110: HITAG reader chip

## Nets that join several sheets
GND: Master (29 pins), S1 (13 pins), S2 (13 pins), S3 (13 pins), S4 (13 pins), S5 (13 pins), S6 (13 pins), S7 (13 pins), S8 (13 pins)
P3V3: Master (28 pins), S1 (8 pins), S2 (8 pins), S3 (8 pins), S4 (8 pins), S5 (8 pins), S6 (8 pins), S7 (8 pins), S8 (8 pins)
P5V0: Master (8 pins), S1 (C3A.2 C4A.1 U2A.3 U2A.5), S2 (C3B.2 C4B.1 U2B.3 U2B.5), S3 (C3C.2 C4C.1 U2C.3 U2C.5), S4 (C3D.2 C4D.1 U2D.3 U2D.5), S5 (C3E.2 C4E.1 U2E.3 U2E.5), S6 (C3F.2 C4F.1 U2F.3 U2F.5), S7 (C3G.2 C4G.1 U2G.3 U2G.5), S8 (C3H.2 C4H.1 U2H.3 U2H.5)
IN_N1: Master (J1.1), S1 (C5A.1 C6A.2)
IN_N2: Master (J1.3), S2 (C5B.1 C6B.2)
IN_N3: Master (J2.1), S3 (C5C.1 C6C.2)
IN_N4: Master (J2.3), S4 (C5D.1 C6D.2)
IN_N5: Master (J3.1), S5 (C5E.1 C6E.2)
IN_N6: Master (J3.3), S6 (C5F.1 C6F.2)
IN_N7: Master (J4.1), S7 (C5G.1 C6G.2)
IN_N8: Master (J4.3), S8 (C5H.1 C6H.2)
IN_P1: Master (J1.4), S1 (U2A.4)
IN_P2: Master (J1.2), S2 (U2B.4)
IN_P3: Master (J2.4), S3 (U2C.4)
IN_P4: Master (J2.2), S4 (U2D.4)
IN_P5: Master (J3.4), S5 (U2E.4)
IN_P6: Master (J3.2), S6 (U2F.4)
IN_P7: Master (J4.4), S7 (U2G.4)
IN_P8: Master (J4.2), S8 (U2H.4)
MISO: Master (U1.16), S1 (R1A.1), S2 (R1B.1), S3 (R1C.1), S4 (R1D.1), S5 (R1E.1), S6 (R1F.1), S7 (R1G.1), S8 (R1H.1)
MOSI: Master (U1.15), S1 (IC1A.9), S2 (IC1B.9), S3 (IC1C.9), S4 (IC1D.9), S5 (IC1E.9), S6 (IC1F.9), S7 (IC1G.9), S8 (IC1H.9)
SCK: Master (R10.2 U1.17), S1 (IC1A.2), S2 (IC1B.2), S3 (IC1C.2), S4 (IC1D.2), S5 (IC1E.2), S6 (IC1F.2), S7 (IC1G.2), S8 (IC1H.2)
SS_BUS1: Master (U1.40), S1 (R4A.1 U1A.6)
SS_BUS2: Master (U1.41), S2 (R4B.1 U1B.6)
SS_BUS3: Master (U1.42), S3 (R4C.1 U1C.6)
SS_BUS4: Master (U1.43), S4 (R4D.1 U1D.6)
SS_BUS5: Master (U1.44), S5 (R4E.1 U1E.6)
SS_BUS6: Master (U1.1), S6 (R4F.1 U1F.6)
SS_BUS7: Master (U1.2), S7 (R4G.1 U1G.6)
SS_BUS8: Master (U1.3), S8 (R4H.1 U1H.6)
XTAL1: Master (OSC1.3), S1 (U1A.2 U2A.6), S2 (U1B.2 U2B.6), S3 (U1C.2 U2C.6), S4 (U1D.2 U2D.6), S5 (U1E.2 U2E.6), S6 (U1F.2 U2F.6), S7 (U1G.2 U2G.6), S8 (U1H.2 U2H.6)

## Assembly variants
Corrects from PCB: alternate parts C7 -> CC0603_100NF_50V_10%_X5R